# Altium schematic sheet Altium.schdoc
size 230 x 170 mm
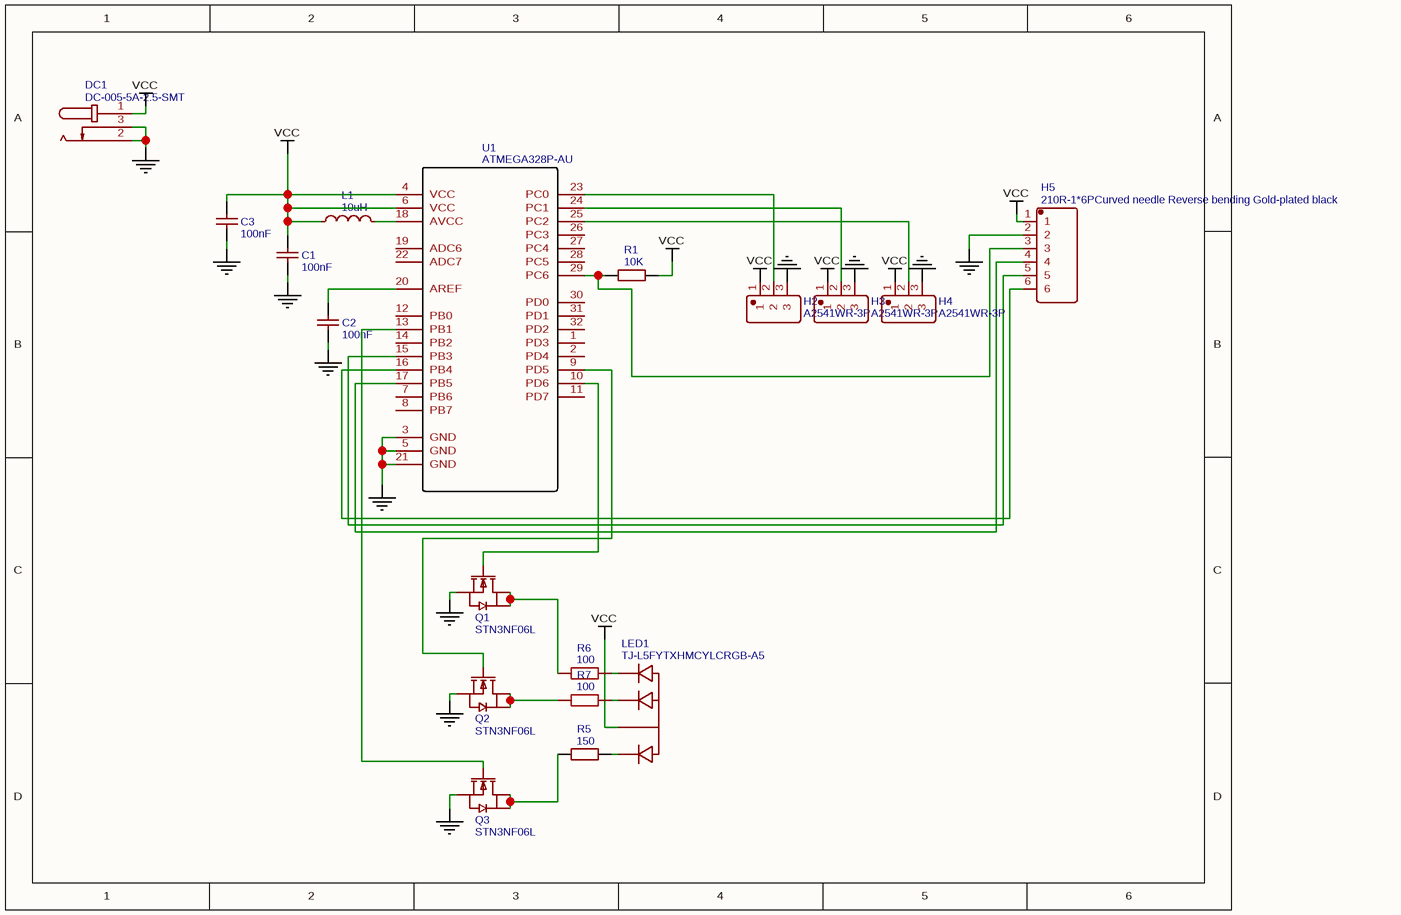
[diagram p0: Altium.schdoc]

## Parts
C1  100nF  [1206]
C2  100nF  [1206]
C3  100nF  [1206]
DC1  DC-005-5A-2.5-SMT  [DC-005-5A-2.0-SMT]
H2  A2541WR-3P  [SIP-2.54MM-3P-CJT-H2.54]
H3  A2541WR-3P  [SIP-2.54MM-3P-CJT-H2.54]
H4  A2541WR-3P  [SIP-2.54MM-3P-CJT-H2.54]
H5  210R-1*6PCurved needle Reverse bending Gold-plated black  [HDR-2.54-1X6PW]
L1  10uH  [1206]
LED1  TJ-L5FYTXHMCYLCRGB-A5  [LED-DIP-4P(5.8MM)]
Q1  STN3NF06L  [SOT-223]
Q2  STN3NF06L  [SOT-223]
Q3  STN3NF06L  [SOT-223]
R1  10K  [1206]
R5  150  [1206]
R6  100  [1206]
R7  100  [1206]
U1  ATMEGA328P-AU  [TQFP-32_7X7X08P]

## Nets
GND: C1.1 C2.1 C3.1 DC1.2 DC1.3 H2.3 H3.3 H4.3 H5.2 Q1.3(S) Q2.3(S) Q3.3(S) U1.3(GND) U1.5(GND) U1.21(GND)
VCC: C1.2 C3.2 DC1.1 H2.1 H3.1 H4.1 H5.1 L1.1 LED1.2(+) R1.2 U1.4(VCC) U1.6(VCC)
NetC2_2: C2.2 U1.20(AREF)
NetH2_2: H2.2 U1.23(PC0)
NetH3_2: H3.2 U1.24(PC1)
NetH4_2: H4.2 U1.25(PC2)
NetH5_3: H5.3 R1.1 U1.29(PC6)
NetH5_4: H5.4 U1.17(PB5)
NetH5_5: H5.5 U1.15(PB3)
NetH5_6: H5.6 U1.16(PB4)
NetL1_2: L1.2 U1.18(AVCC)
NetLED1_1: LED1.1 R5.2
NetLED1_3: LED1.3 R7.2
NetLED1_4: LED1.4 R6.2
NetQ1_1: Q1.1(G) U1.10(PD6)
NetQ1_2: Q1.2(D) Q1.4(D) R6.1
NetQ2_1: Q2.1(G) U1.9(PD5)
NetQ2_2: Q2.2(D) Q2.4(D) R7.1
NetQ3_1: Q3.1(G) U1.13(PB1)
NetQ3_2: Q3.2(D) Q3.4(D) R5.1

Not connected (* = marked no-connect by the designer): U1 1(PD3) 2(PD4) 7(PB6) 8(PB7) 11(PD7) 12(PB0) 14(PB2) 19(ADC6) 22(ADC7) 26(PC3) 27(PC4) 28(PC5) 30(PD0) 31(PD1) 32(PD2)

## Library data of the parts
C1-C3 = 100nF: BOM_Manufacturer: YAGEO; BOM_Manufacturer Part: CC1206KKX7R0BB104; nameAlias: Capacitance; BOM_Supplier: LCSC; BOM_Supplier Part: C107181; spicePre: C; spiceSymbolName: CC1206KKX7R0BB104
DC1 = DC-005-5A-2.5-SMT: BOM_Manufacturer: XKB Enterprise; Contributor: LCSC; BOM_Supplier: LCSC; BOM_Supplier Part: C319133; BOM_Manufacturer Part: DC-005-5A-2.5-SMT; spicePre: D
H2-H4 = A2541WR-3P: BOM_Manufacturer: Changjiang Connectors; Contributor: LCSC; BOM_Supplier: LCSC; BOM_Supplier Part: C225489; BOM_Manufacturer Part: A2541WR-3P; spicePre: H
H5 = 210R-1*6PCurved needle Reverse bending Gold-plated black: BOM_Manufacturer: Ckmtw; Contributor: LCSC; BOM_Supplier: LCSC; BOM_Manufacturer Part: 210R-1*6PCurved needle Reverse bending Gold-plated black; BOM_Supplier Part: C124367; spicePre: H
L1 = 10uH: BOM_Manufacturer: FH; BOM_Manufacturer Part: CMP321609XD100KT; nameAlias: Inductance; BOM_Supplier: LCSC; BOM_Supplier Part: C139251; spicePre: L; spiceSymbolName: CMP321609XD100KT
LED1 = TJ-L5FYTXHMCYLCRGB-A5: BOM_Manufacturer: TOGIALED; Contributor: LCSC; BOM_Supplier: LCSC; BOM_Supplier Part: C331057; BOM_Manufacturer Part: TJ-L5FYTXHMCYLCRGB-A5; spicePre: L
Q1-Q3 = STN3NF06L: BOM_Manufacturer: STMicroelectronics; Contributor: LCSC; BOM_Supplier: LCSC; BOM_Supplier Part: C222218; BOM_Manufacturer Part: STN3NF06L; spicePre: Q
R1 = 10K: BOM_Manufacturer: UniOhm; BOM_Manufacturer Part: 1206W4F1002T5E; nameAlias: Resistance (Ohms); BOM_Supplier: LCSC; BOM_LCSC Assembly: Yes; BOM_Supplier Part: C17902; spicePre: R; spiceSymbolName: 1206W4F1002T5E
R5 = 150: BOM_Manufacturer: UniOhm; BOM_Manufacturer Part: 1206W4F1500T5E; nameAlias: Resistance (Ohms); BOM_Supplier: LCSC; BOM_Supplier Part: C17917; spicePre: R; spiceSymbolName: 1206W4F1500T5E
R6 R7 = 100: BOM_Manufacturer: Viking Tech; BOM_Manufacturer Part: AR06DTCV1000; nameAlias: Resistance (Ohms); Contributor: LCSC; BOM_Supplier: LCSC; BOM_Supplier Part: C319959; spicePre: R; spiceSymbolName: AR06DTCV1000
U1 = ATMEGA328P-AU: BOM_Manufacturer: MICROCHIP; BOM_Supplier: LCSC; BOM_Manufacturer Part: ATMEGA328P-AU; image: //image.lceda.cn/szlcsc/C14877.jpg; BOM_Supplier Part: C14877; spicePre: U